# Altium project GSV2_TFB_ToF.PrjPcb
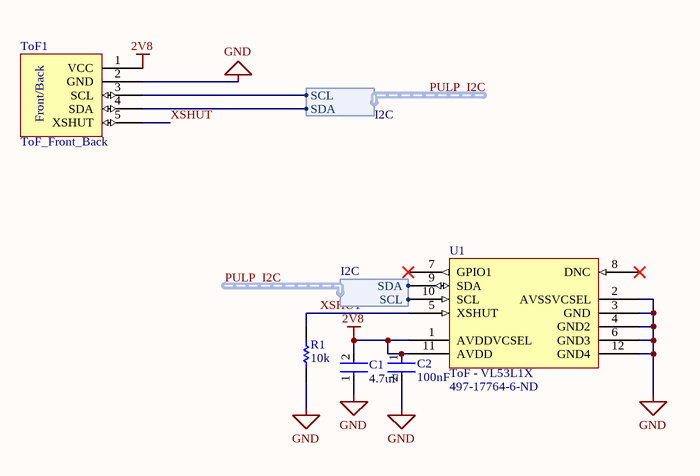
[diagram p0: 01_ToF.SchDoc]
1 sheet, 5 parts. Net scope: global (net labels, ports and power ports of the same name join across sheets).
Board file: PCB_FB_TOF.PcbDoc

## Sheet 01_ToF.SchDoc: GAP9Shield: TOFs
size A3; DrawnBy: Hanna Müller and Victor Kartsch; Organization: Integrated Systems Laboratory; DocumentNumber: 1; Revision: v1.0; SheetNumber: 1; SheetTotal: 1

### Parts
C1  4.7uF  [FP-GRM035-0_09-IPC_B]
C2  100nF  [FP-C0603-030-0_03-IPC_C]
R1  value 10k  [RESC0603X28X15LL05T05]  (hidden comment: CRCW020110K0FNED)
ToF1  ToF_Front_Back  [ToF_Front_Back]
U1  ToF - VL53L1X  Supplier Part Number 1: 497-17764-6-ND  [TOF]

### Harnesses
I2C: SDA, SCL

### Nets
2V8: C1.2 C2.1 ToF1.1(VCC) U1.1(AVDDVCSEL) U1.11(AVDD)
GND: C1.1 C2.2 R1.2 ToF1.2(GND) U1.2(AVSSVCSEL) U1.3(GND) U1.4(GND2) U1.6(GND3) U1.12(GND4)
PULP_I2C.SCL: ToF1.3(SCL) U1.10(SCL) ; harness I2C.SCL
PULP_I2C.SDA: ToF1.4(SDA) U1.9(SDA) ; harness I2C.SDA
XSHUT: R1.1 ToF1.5(XSHUT) U1.5(XSHUT)

Not connected (* = marked no-connect by the designer): U1 7(GPIO1)* 8(DNC)*

### Notes on the sheet
- 1
- 2
- 3
- 4
- 5
- 6
- 7
- 8
- A
- B
- C
- D
- Project:
- Date:
- Drawing number:
- Rev:
- Format:
- A3
- Drawn by:
- Laboratory:
- Page
- Sheet:
- of
- File:
- (in symbol ToF_Front_Back) Front/Back

### Library data of the parts
C1 = CMP-06035-019701-1: Chip Multilayer Ceramic Capacitors for General Purpose, 0201, 4.7uF, X5R, 15%, 20%, 6.3V; Capacitance: 4.7uF; Max Operating Temperature: 85°C; Packaging: Tape and Reel; Voltage Rating: 6.3V; Min Operating Temperature: -55°C; Case/Package: 0201; Voltage Rating (DC): 6.3V; Tolerance: 20%; Length: 0.024inch; Dielectric: X5R; Case Code (Imperial): 0201; Case Code (Metric): 0603; Width: 0.012inch; Mount: Surface Mount; Thickness: 0.022inch
C2 = CMP-08246-005139-1: Multilayer Ceramic Capacitors 100nF ±10% 25V X5R SMD 0201; Min Operating Temperature: -55°C; Tolerance: 10%; Height: 0.3mm; Capacitance: 100nF; Lead Free: Lead Free; Width: 0.012inch; Dielectric Material: Ceramic; Voltage Rating (DC): 25V; Voltage Rating: 25V; Thickness: 0.013inch; Depth: 0.3mm; Case Code (Imperial): 0201; Max Operating Temperature: 85°C; Case/Package: 0201; Series: C; RoHS Compliant: Yes; Packaging: Tape and Reel; Weight: 6E-06oz; Dielectric: X5R; Length: 0.6mm; Mount: Surface Mount; Case Code (Metric): 0603; Termination: SMD/SMT; REACH SVHC: No SVHC; Package Quantity: 15000; Value: 100nF
R1 = CMP-2004-00016-1: Manufacturer: Vishay Dale; Part Number: CRCW020110K0FNED
U1 = VL53L1X: Manufacturer: STMicroelectronics; Manufacturer Part Number: VL53L1CXV0FY/1; Supplier 1: Digi-Key; Stock 1: 5939; Pricing 1: 1 = 7.07000, 10 = 6.38600, 100 = 5.28660, 500 = 4.60350, 1000 = 4.00950 (USD); RoHS: No; ComponentLink1URL: http://www.farnell.com/datasheets/2600105.pdf?src-supplier=Farnell; ComponentLink1Description: http://www.farnell.com/datasheets/2600105.pdf?src-supplier=Farnell; ComponentLink2URL: http://www.st.com/content/ccc/resource/technical/document/datasheet/group3/7d/85/c8/95/fb/3b/4e/2d/DM00452094/files/DM00452094.pdf/jcr:content/translations/en.DM00452094.pdf?src-supplier=Digi-Key; ComponentLink2Description: http://www.st.com/content/ccc/resource/technical/document/datasheet/group3/7d/85/c8/95/fb/3b/4e/2d/DM00452094/files/DM00452094.pdf/jcr:content/translations/en.DM00452094.pdf?src-supplier=Digi-Key
ToF1 = ToF_Front_Back: Supplier 1: Digi-Key; Supplier Part Number 1: 110990442-ND